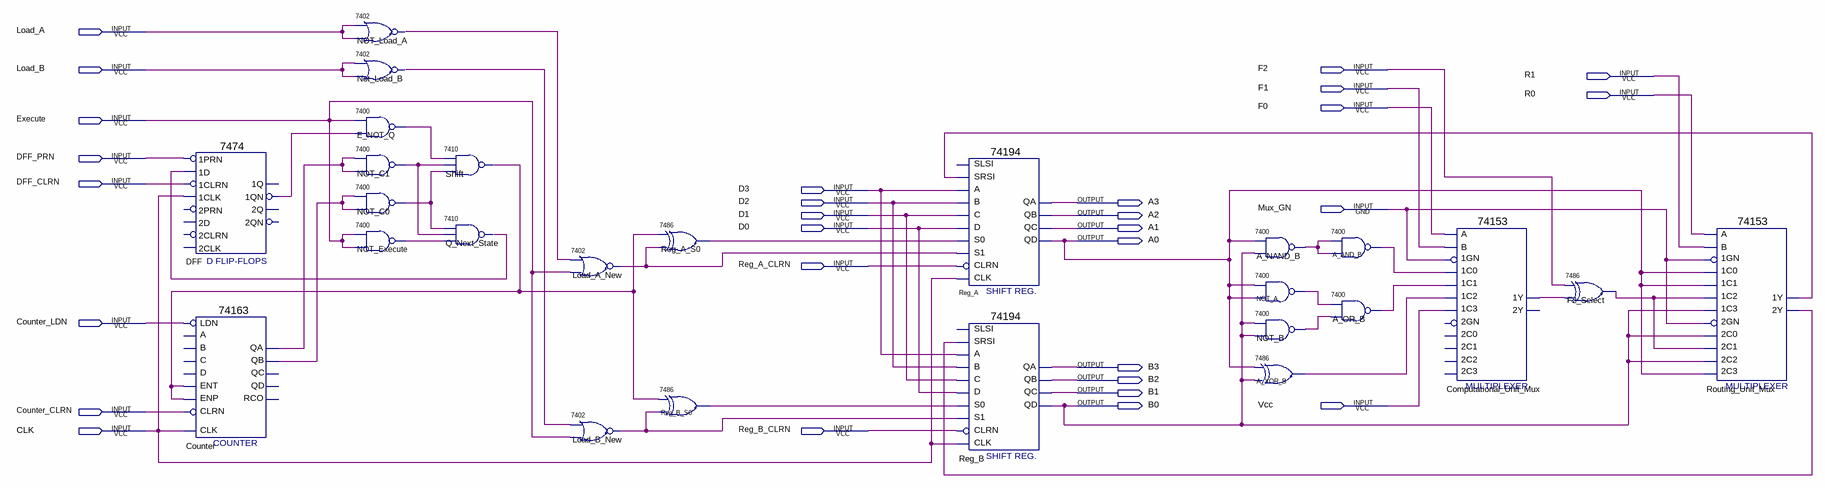
[diagram p0: schematic sheet]
// Quartus schematic logic_processor_4_bit_schematic.bdf as structural Verilog: 25 symbols, 29 pins
module logic_processor_4_bit_schematic (
  input  Load_A,
  input  Load_B,
  input  F2,
  input  R1,
  input  F1,
  input  R0,
  input  F0,
  input  Execute,
  input  DFF_PRN,
  input  DFF_CLRN,
  input  D3,
  input  D2,
  input  Mux_GN,
  input  D1,
  input  D0,
  input  Reg_A_CLRN,
  input  Counter_LDN,
  input  Vcc,
  input  Counter_CLRN,
  input  CLK,
  input  Reg_B_CLRN,
  output A3,
  output A2,
  output A1,
  output A0,
  output B3,
  output B2,
  output B1,
  output B0
);

  wire A_AND_B_1, A_NAND_B_1, A_OR_B_1, A_XOR_B_1, Computational_Unit_Mux_1y, Counter_qa, Counter_qb,
       DFF_1qn, E_NOT_Q_1, F2_Select_1, Load_A_New_1, Load_B_New_1, NOT_A_1, NOT_B_1, NOT_C0_1, NOT_C1_1,
       NOT_Execute_1, NOT_Load_A_1, Not_Load_B_1, Q_Next_State_1, Reg_A_S0_1, Reg_B_S0_1,
       Routing_Unit_Mux_1y, Routing_Unit_Mux_2y, Shift_1;

  \7474  DFF (
    .\1CLK (CLK), .\1D (Q_Next_State_1), .\1PRN (DFF_PRN), .\1CLRN (DFF_CLRN), .\1QN (DFF_1qn));  // open: 2D, 2PRN, 2CLK, 2CLRN, 2Q, 2QN, 1Q
  \74163  Counter (
    .ENT(Shift_1), .CLRN(Counter_CLRN), .CLK(CLK), .ENP(Shift_1), .LDN(Counter_LDN), .QA(Counter_qa),
    .QB(Counter_qb));  // open: C, B, A, D, QC, QD, RCO
  \7402  NOT_Load_A (.\2 (Load_A), .\3 (Load_A), .\1 (NOT_Load_A_1));
  \7402  Not_Load_B (.\2 (Load_B), .\3 (Load_B), .\1 (Not_Load_B_1));
  \7400  E_NOT_Q (.\3 (DFF_1qn), .\2 (Execute), .\1 (E_NOT_Q_1));
  \7400  NOT_C1 (.\3 (Counter_qa), .\2 (Counter_qa), .\1 (NOT_C1_1));
  \7400  NOT_C0 (.\3 (Counter_qb), .\2 (Counter_qb), .\1 (NOT_C0_1));
  \7400  NOT_Execute (.\3 (Execute), .\2 (Execute), .\1 (NOT_Execute_1));
  \7410  Shift (.\2 (E_NOT_Q_1), .\3 (NOT_C1_1), .\4 (NOT_C0_1), .\1 (Shift_1));
  \7410  Q_Next_State (.\2 (NOT_C0_1), .\3 (NOT_C1_1), .\4 (NOT_Execute_1), .\1 (Q_Next_State_1));
  \7402  Load_A_New (.\2 (NOT_Load_A_1), .\3 (Execute), .\1 (Load_A_New_1));
  \7402  Load_B_New (.\2 (Not_Load_B_1), .\3 (Execute), .\1 (Load_B_New_1));
  \7486  Reg_A_S0 (.\2 (Shift_1), .\3 (Load_A_New_1), .\1 (Reg_A_S0_1));
  \7486  Reg_B_S0 (.\2 (Shift_1), .\3 (Load_B_New_1), .\1 (Reg_B_S0_1));
  \74194  Reg_A (
    .SRSI(Routing_Unit_Mux_1y), .B(D2), .C(D1), .CLK(CLK), .CLRN(Reg_A_CLRN), .D(D0), .S1(Load_A_New_1),
    .S0(Reg_A_S0_1), .A(D3), .QA(A3), .QB(A2), .QC(A1), .QD(A0));  // open: SLSI
  \74194  Reg_B (
    .SRSI(Routing_Unit_Mux_2y), .B(D2), .C(D1), .CLK(CLK), .CLRN(Reg_B_CLRN), .D(D0), .S1(Load_B_New_1),
    .S0(Reg_B_S0_1), .A(D3), .QA(B3), .QB(B2), .QC(B1), .QD(B0));  // open: SLSI
  \7400  A_NAND_B (.\3 (B0), .\2 (A0), .\1 (A_NAND_B_1));
  \7400  NOT_A (.\3 (A0), .\2 (A0), .\1 (NOT_A_1));
  \7400  NOT_B (.\3 (B0), .\2 (B0), .\1 (NOT_B_1));
  \7486  A_XOR_B (.\2 (A0), .\3 (B0), .\1 (A_XOR_B_1));
  \7400  A_AND_B (.\3 (A_NAND_B_1), .\2 (A_NAND_B_1), .\1 (A_AND_B_1));
  \7400  A_OR_B (.\3 (NOT_B_1), .\2 (NOT_A_1), .\1 (A_OR_B_1));
  \74153  Computational_Unit_Mux (
    .\1C1 (A_OR_B_1), .\1GN (Mux_GN), .\1C0 (A_AND_B_1), .\1C2 (A_XOR_B_1), .\1C3 (Vcc), .B(F1), .A(F0),
    .\1Y (Computational_Unit_Mux_1y));  // open: 2C0, 2GN, 2C2, 2C1, 2C3, 2Y
  \7486  F2_Select (.\2 (F2), .\3 (Computational_Unit_Mux_1y), .\1 (F2_Select_1));
  \74153  Routing_Unit_Mux (
    .\1C1 (A0), .\1GN (Mux_GN), .\1C0 (A0), .\2C0 (B0), .\2GN (Mux_GN), .\2C2 (B0), .\1C2 (F2_Select_1),
    .\1C3 (B0), .B(R1), .A(R0), .\2C1 (F2_Select_1), .\2C3 (A0), .\1Y (Routing_Unit_Mux_1y),
    .\2Y (Routing_Unit_Mux_2y));
endmodule
